# EAGLE design pic18f2550usbhdiio (EAGLE 6.1)
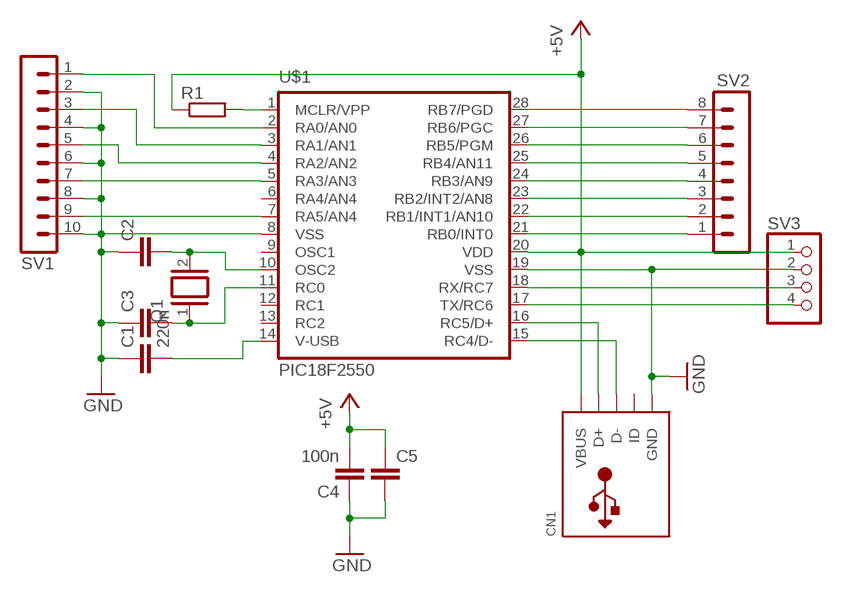
[diagram p0: schematic, sheet 1]

## Parts
C1  220n  C-EU025-025X050  [C025-025X050]
C2  C-EU025-025X050  [C025-025X050]
C3  C-EU025-025X050  [C025-025X050]
C4  100n  C-EU025-025X050  [C025-025X050]
C5  C-EUC0805K  [C0805K]
CN1  USBMOLEX  [USB-MINIB-THM-MOLEX]
Q1  XTAL/S  [QS]
R1  R-EU_0207/10  [0207/10]
SV1  MA10-1  [MA10-1]
SV2  MA08-1  [MA08-1]
SV3  PINHD-1X4  [1X04]
U$1  PIC18F2550  [DIL28-3]

## Nets
+5V: C4.2 C5.1 CN1.VBUS R1.1 SV3.1 U$1.20(VDD)
D+: CN1.D+ U$1.16(RC5/D+)
D-: CN1.D- U$1.15(RC4/D-)
GND: C1.1 C2.1 C3.1 C4.1 C5.2 CN1.GND SV1.2 SV1.4 SV1.6 SV1.8 SV1.10 SV3.2 U$1.8(VSS) U$1.19(VSS)
N$1: SV1.1 U$1.2(RA0/AN0)
N$2: SV1.3 U$1.3(RA1/AN1)
N$3: SV1.5 U$1.4(RA2/AN2)
N$4: SV1.7 U$1.5(RA3/AN3)
N$5: SV1.9 U$1.7(RA5/AN4)
N$6: SV3.3 U$1.18(RX/RC7)
N$7: SV2.1 U$1.21(RB0/INT0)
N$8: SV2.2 U$1.22(RB1/INT1/AN10)
N$9: SV2.3 U$1.23(RB2/INT2/AN8)
N$10: SV2.4 U$1.24(RB3/AN9)
N$11: SV2.5 U$1.25(RB4/AN11)
N$12: SV2.6 U$1.26(RB5/PGM)
N$13: SV2.7 U$1.27(RB6/PGC)
N$14: SV2.8 U$1.28(RB7/PGD)
N$15: C3.2 Q1.1 U$1.11(RC0)
N$16: C2.2 Q1.2 U$1.10(OSC2)
N$17: C1.2 U$1.14(V-USB)
N$18: SV3.4 U$1.17(TX/RC6)
N$22: R1.2 U$1.1(MCLR/VPP)
Unconnected: CN1.ID U$1.6(RA4/AN4) U$1.9(OSC1) U$1.12(RC1) U$1.13(RC2)

## Library data of the parts
C1-C5 = rcl:C-EU: CAPACITOR, European symbol
CN1 = adafruit:USB: USB Connectors USBMINIB - Surface Mount Female Mini-B USB Connector 4UConnector: 06564 By microbuilder.eu Thru-hole RA Female Mini-B USB Connector 4UConnector: 18732 By ladyada.net
Q1 = special:XTAL/S: CRYSTAL
R1 = rcl:R-EU_: RESISTOR, European symbol
SV1 = con-lstb:MA10-1: PIN HEADER; OC_FARNELL: unknown; OC_NEWARK: unknown
SV2 = con-lstb:MA08-1: PIN HEADER; OC_FARNELL: unknown; OC_NEWARK: unknown
SV3 = pinhead:PINHD-1X4: PIN HEADER
U$1 = SparkFun:PIC18F2550

## Board
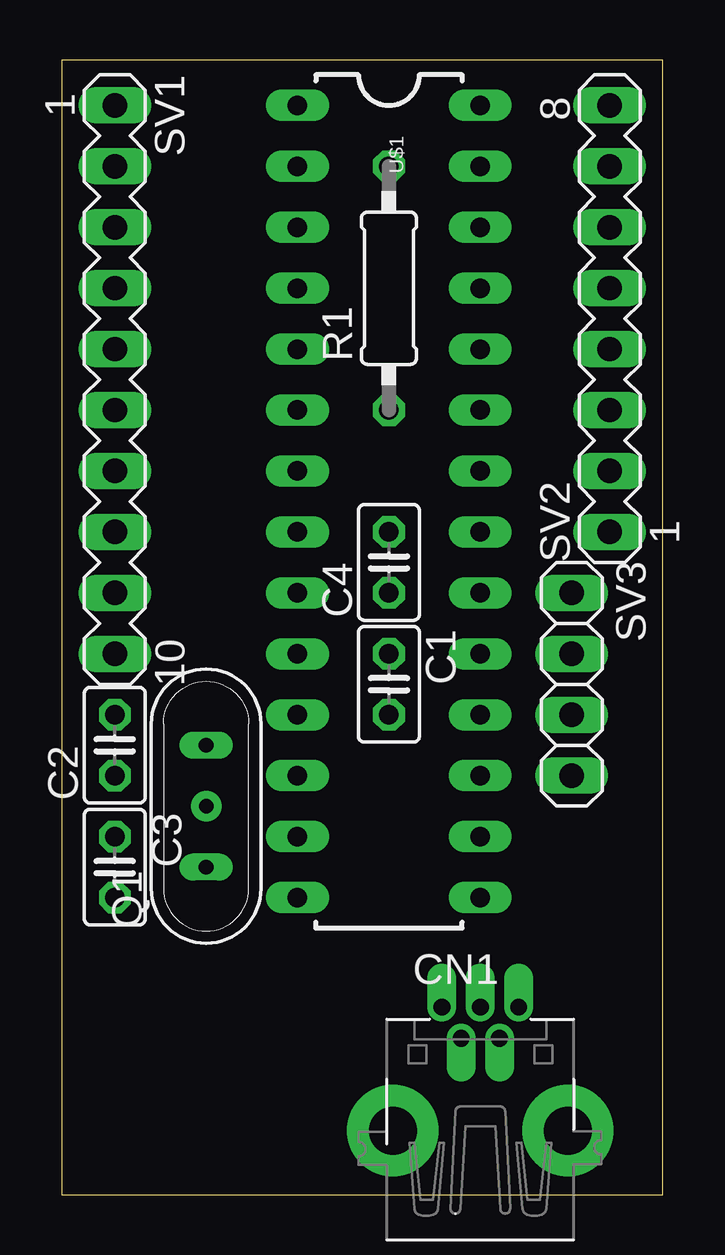
[diagram p1: board, top side]
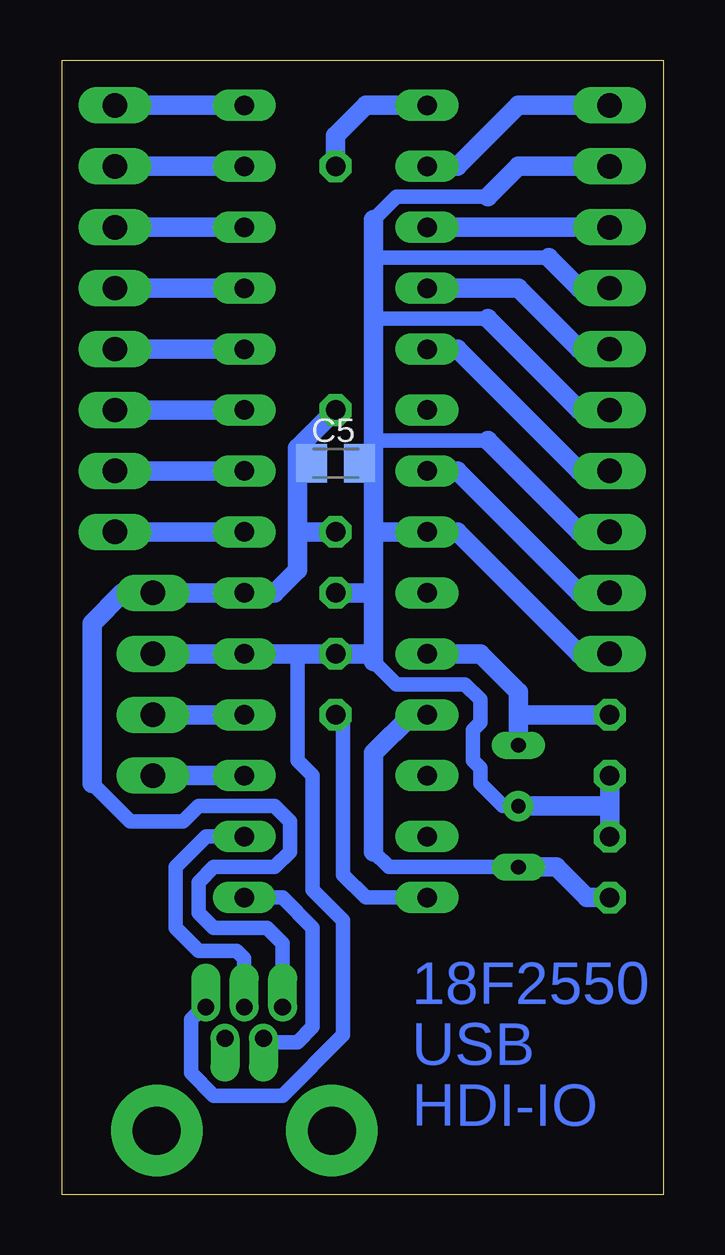
[diagram p2: board, bottom side, seen from below]

Size 25.06 x 47.3 mm. Coordinates in mm from the lower left corner, seen from the top.
Outline: 0,0 25.06,0 25.06,47.3 0,47.3 0,0
Copper layers (1*16): Top 0.035mm / dielectric 1.5mm / Bottom 0.035mm
Design rules: minimum track width 10mil, minimum drill 24mil, track to track 8mil, track to pad 8mil, pad to pad 8mil, via to via 8mil, smd to smd 8mil, copper to edge 40mil, drill to drill 8mil, minimum pad ring 10mil, minimum via ring 8mil, stop-mask expansion 4mil, vias tented up to drill 0mil, thermal gap 10mil

### Footprints (pad centres in the part's own frame; a part is rotated, then mirrored left to right if it is on the bottom)
C025-025X050 = drill 0.813 octagon: 1 -1.27,0; 2 1.27,0
C0805K = smd 1.3 x 1.6: 1 -1,0; 2 1,0
USB-MINIB-THM-MOLEX = drill 0.7 offset: D+ 0,9.72; D- -0.8,8.42; GND 1.6,9.72; ID 0.8,8.42; VBUS -1.6,9.72 | drill 2 pad 3.81: GND1 -3.65,4.57; GND4 3.65,4.57
QS = drill 0.61 long: 1 -2.54,0; 2 2.54,0
0207/10 = drill 0.813 octagon: 1 -5.08,0; 2 5.08,0
MA10-1 = drill 1.016 long: 1 -11.43,0; 2 -8.89,0; 3 -6.35,0; 4 -3.81,0; 5 -1.27,0; 6 1.27,0; 7 3.81,0; 8 6.35,0; 9 8.89,0; 10 11.43,0
MA08-1 = drill 1.016 long: 1 -8.89,0; 2 -6.35,0; 3 -3.81,0; 4 -1.27,0; 5 1.27,0; 6 3.81,0; 7 6.35,0; 8 8.89,0
1X04 = drill 1.016 long: 1 -3.81,0; 2 -1.27,0; 3 1.27,0; 4 3.81,0
DIL28-3 = drill 0.813 long: 1 -16.51,-3.81; 2 -13.97,-3.81; 3 -11.43,-3.81; 4 -8.89,-3.81; 5 -6.35,-3.81; 6 -3.81,-3.81; 7 -1.27,-3.81; 8 1.27,-3.81; 9 3.81,-3.81; 10 6.35,-3.81; 11 8.89,-3.81; 12 11.43,-3.81; 13 13.97,-3.81; 14 16.51,-3.81; 15 16.51,3.81; 16 13.97,3.81; 17 11.43,3.81; 18 8.89,3.81; 19 6.35,3.81; 20 3.81,3.81; 21 1.27,3.81; 22 -1.27,3.81; 23 -3.81,3.81; 24 -6.35,3.81; 25 -8.89,3.81; 26 -11.43,3.81; 27 -13.97,3.81; 28 -16.51,3.81

### Placement (x,y rotation side)
C1  13.65,21.27 270 top
C2  2.22,18.73 90 top
C3  2.22,13.65 270 top
C4  13.65,26.35 90 top
C5  13.65,30.48 0 bottom
CN1  17.46,-1.91 0 top
Q1  6.03,16.19 90 top
R1  13.65,37.78 90 top
SV1  2.22,33.97 270 top
SV2  22.86,36.51 90 top
SV3  21.27,21.27 270 top
U$1  13.65,28.89 270 top

### Tracks (layer width: path | path; a pad name or v marks a point on that pad's centre or on a via)
+5V
  Bottom 0.61: 23.81,17.14 22.23,15.56 20,15.56 19.37,16.19 16.19,16.19 15.56,15.56 15.56,14.29 16.19,13.65 18.73,13.65 19.37,13.02 19.37,11.75 18.73,11.11 16.51,11.11 15.88,10.48 15.88,7.83 CN1.VBUS
  Bottom 0.813: R1.1 15.24,31.11 15.24,30.48 | 15.24,30.48 15.24,27.62 | 23.81,17.14 23.81,23.81 22.54,25.08 SV3.1 U$1.20 16.19,25.08 15.24,26.04 15.24,27.62 | C4.2 15.24,27.62 | C5.1 15.24,30.48
D+
  Bottom 0.61: U$1.16 19.05,14.92 20.32,13.65 20.32,11.11 19.37,10.16 17.78,10.16 17.46,9.84 CN1.D+
D-
  Bottom 0.61: U$1.15 15.88,12.38 14.61,11.11 14.61,6.99 15.24,6.35 16.83,6.35 16.83,6.67 16.82,6.67 CN1.D-
GND  (via drill 0.6 pad 1.27)
  Bottom 0.61: 7.3,31.43 12.06,31.43 | 7.3,36.51 12.06,36.51 | 4.76,39.05 12.06,39.05 | 7.3,41.59 11.11,41.59 12.06,40.64 | v6.03,16.19 6.67,16.19 7.62,17.14 7.62,17.78 7.94,18.1 7.94,19.37 7.62,19.68 7.62,20.64 8.26,21.27 11.11,21.27 12.06,22.23 | CN1.GND 19.17,7.82 19.68,7.3 19.68,5.08 18.73,4.13 15.88,4.13 13.34,6.67 13.34,11.43 14.61,12.7 14.61,17.46 15.24,18.1 15.24,22.54
  Bottom 0.813: SV1.10 3.49,22.54 8.57,27.62 U$1.8 12.06,27.62 | SV1.8 3.49,27.62 7.3,31.43 | SV1.6 3.49,32.7 7.3,36.51 | SV1.4 3.49,37.78 4.76,39.05 | SV1.2 6.03,42.86 7.3,41.59 | 12.06,40.64 12.06,39.05 12.06,36.51 12.06,31.43 12.06,30.48 | 2.22,16.19 C3.1 | C2.1 2.22,16.19 | 2.22,16.19 v6.03,16.19 | 12.06,22.54 C1.1 15.24,22.54 U$1.19 SV3.2 | 12.06,22.54 12.06,25.08 | 12.06,25.08 12.06,27.62 | 12.06,22.54 12.06,22.23 | 12.06,30.48 12.06,27.62 | C4.1 12.06,25.08 | C5.2 12.06,30.48
N$1
  Bottom 0.813: SV1.1 6.03,45.4 8.57,42.86 U$1.2
N$2
  Bottom 0.813: SV1.3 U$1.3
N$3
  Bottom 0.813: U$1.4 6.03,37.78 3.49,35.24 SV1.5
N$4
  Bottom 0.813: U$1.5 8.57,35.24 3.49,30.16 SV1.7
N$5
  Bottom 0.813: U$1.7 8.57,30.16 3.49,25.08 SV1.9
N$6
  Bottom 0.813: U$1.18 SV3.3
N$7
  Bottom 0.813: SV2.1 U$1.21
N$8
  Bottom 0.813: U$1.22 SV2.2
N$9
  Bottom 0.813: SV2.3 U$1.23
N$10
  Bottom 0.813: U$1.24 SV2.4
N$11
  Bottom 0.813: SV2.5 U$1.25
N$12
  Bottom 0.813: U$1.26 SV2.6
N$13
  Bottom 0.813: SV2.7 U$1.27
N$14
  Bottom 0.813: U$1.28 SV2.8
N$15
  Bottom 0.61: Q1.1 11.43,13.65 12.06,14.29
  Bottom 0.813: 12.06,14.29 12.06,18.41 10.48,20 U$1.11 | Q1.1 4.45,13.65 3.17,12.38 C3.2
N$16
  Bottom 0.813: C2.2 6.03,20 | Q1.2 6.03,20 | 6.03,20 6.03,20.95 7.62,22.54 U$1.10
N$17
  Bottom 0.61: U$1.14 12.38,12.38 13.34,13.34 13.34,19.68 C1.2
N$18
  Bottom 0.813: U$1.17 SV3.4
N$22
  Bottom 0.813: U$1.1 12.38,45.4 13.65,44.13 R1.2

### Text on the board
Bottom: 18F2550 | USB | HDI-IO